# EAGLE design ATTinyAmpDriver (EAGLE 6.4)
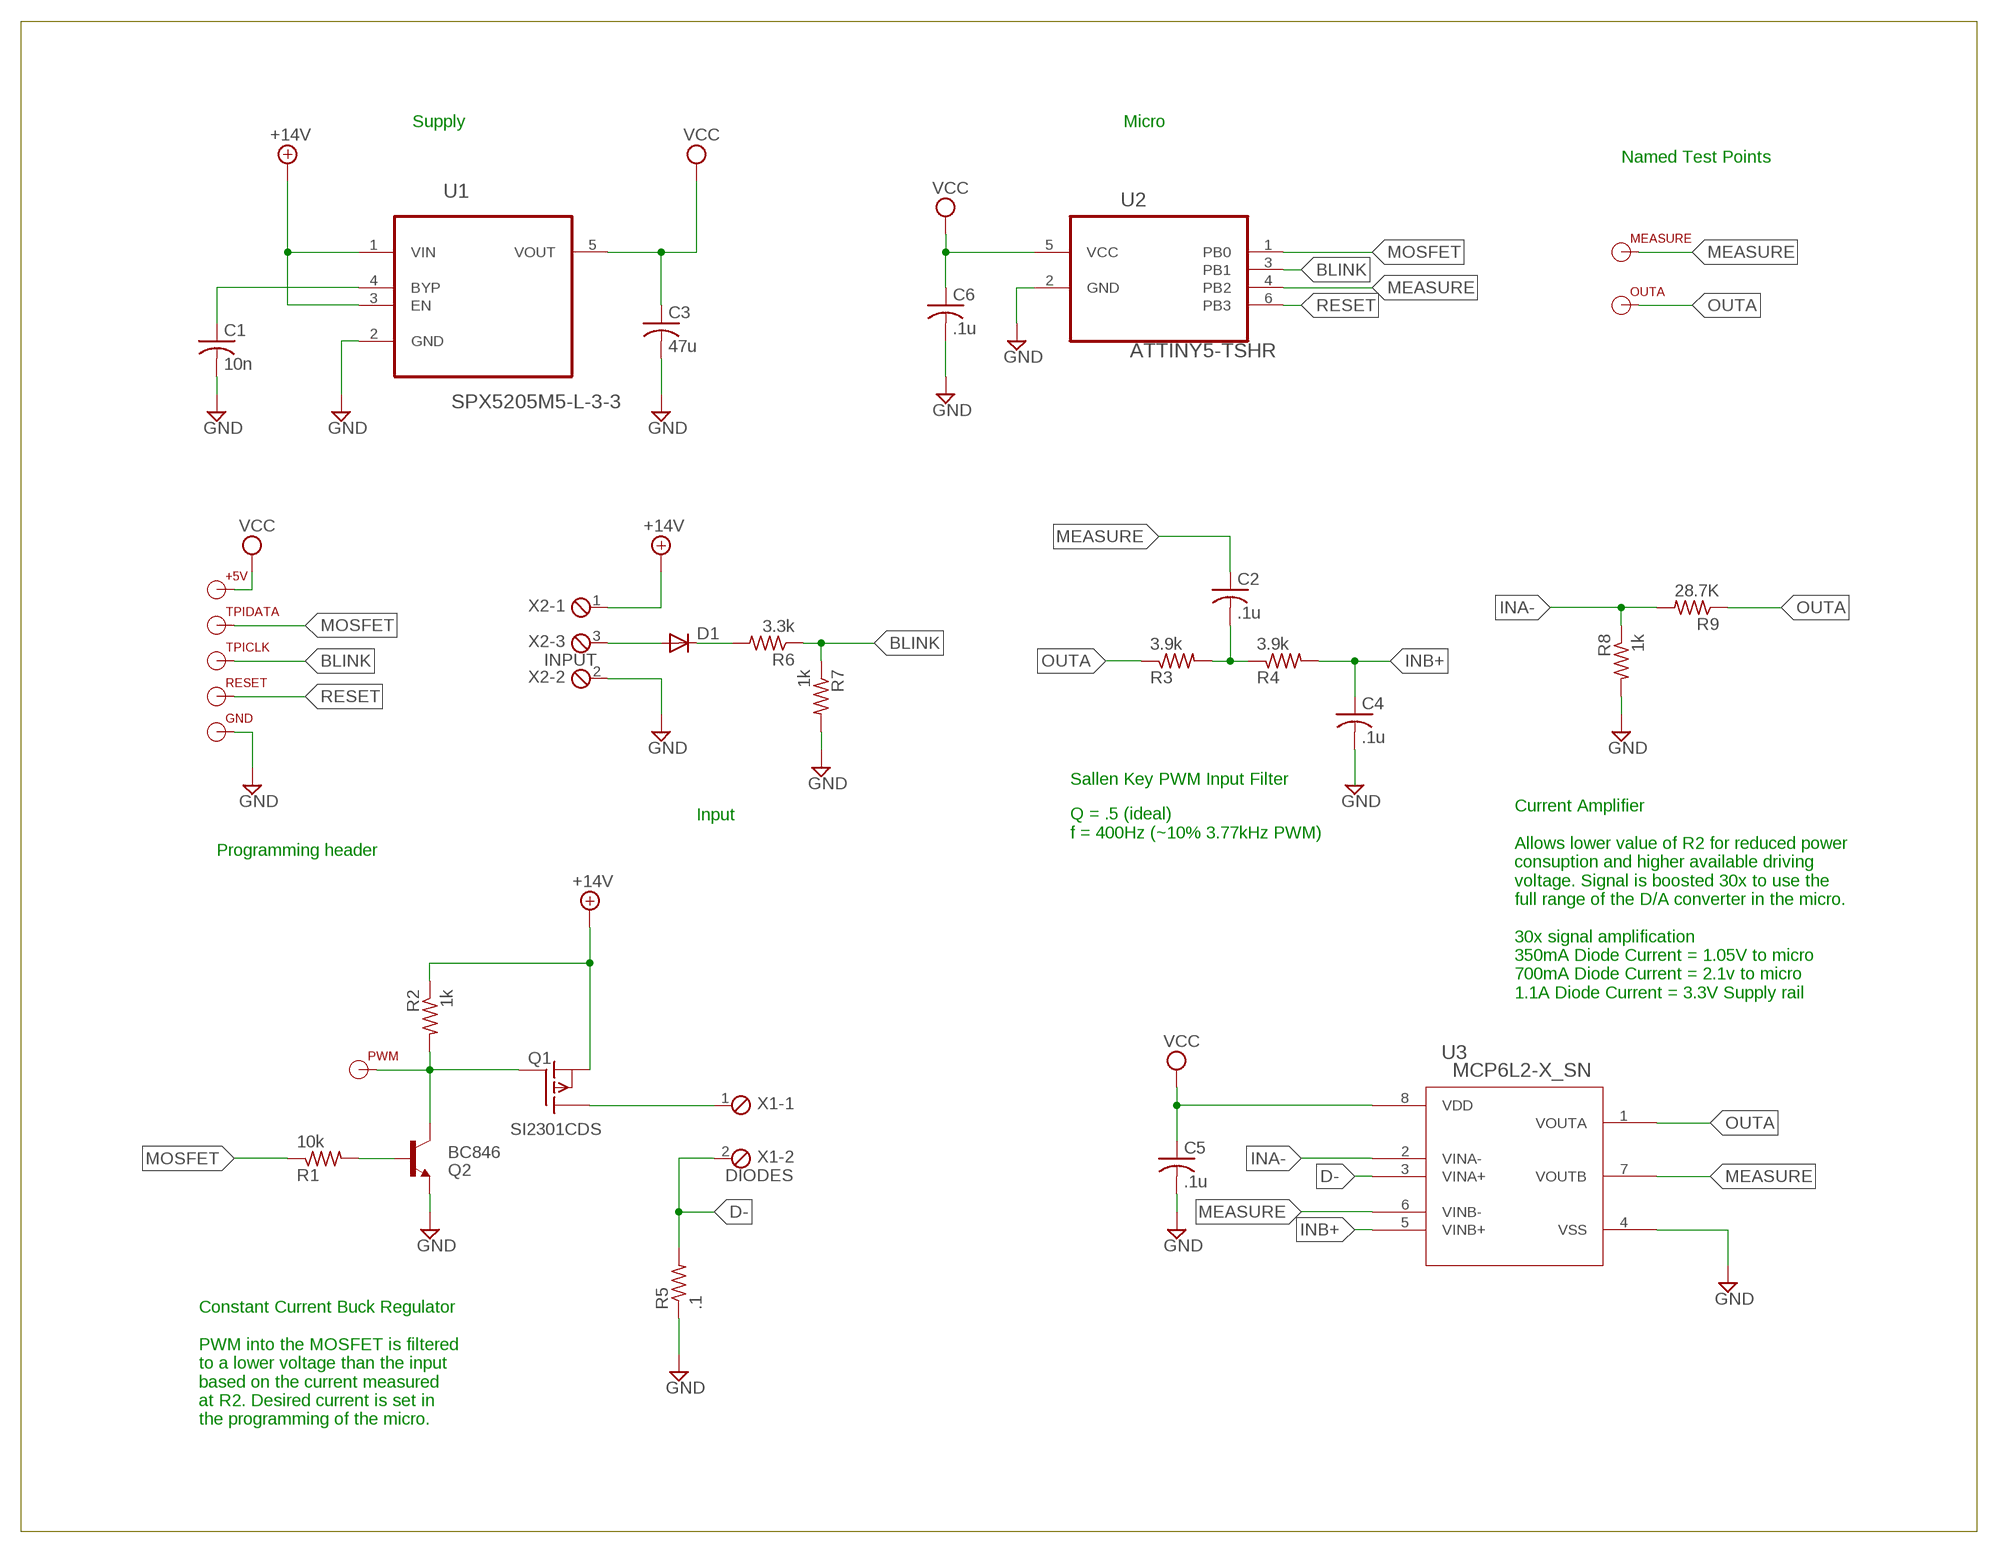
[diagram p0: schematic, sheet 1]

## Parts
+5V  TPI  [TPI_PAD]
C1  10n  C-USC0603  [C0603]
C2  .1u  C-USC0603  [C0603]
C3  47u  C-USC1206  [C1206]
C4  .1u  C-USC0603  [C0603]
C5  .1u  C-USC0603  [C0603]
C6  .1u  C-USC0603  [C0603]
D1  DIODE_0603  [D0603]
GND  TPI  [TPI_PAD]
MEASURE  TPI  [TPI_PAD]
OUTA  TPI  [TPI_PAD]
PWM  TPI  [TPI_PAD]
Q1  SI2301CDS  [SOT-23_POWER]
Q2  BC846  [SOT23]
R1  10k  R-US_R0603  [R0603]
R2  1k  R-US_R0603  [R0603]
R3  3.9k  R-US_R0603  [R0603]
R4  3.9k  R-US_R0603  [R0603]
R5  .1  R-US_R1206  [R1206]
R6  3.3k  R-US_R0603  [R0603]
R7  1k  R-US_R0603  [R0603]
R8  1k  R-US_R0603  [R0603]
R9  28.7K  R-US_R0603  [R0603]
RESET  TPI  [TPI_PAD]
TPICLK  TPI  [TPI_PAD]
TPIDATA  TPI  [TPI_PAD]
U1  SPX5205M5-L-3-3  [SOT95P280X145-5N]
U2  ATTINY5-TSHR  [SOT95P280X145-6N]
U3  MCP6L2-X_SN  [SOIC8-N_MC]
X1  DIODES  MPT2  [2POL254]
X2  INPUT  MPT3  [3POL254]

## Nets
+14V: Q1.P$2(S) R2.1 U1.1(VIN) U1.3(EN) X2.1
BLINK: R6.1 R7.1 TPICLK.P$1(TPI_PIN) U2.3(PB1)
D-: R5.2 U3.3(VINA+) X1.2
GND: C1.2 C3.2 C4.2 C5.2 C6.2 GND.P$1(TPI_PIN) Q2.2(E) R5.1 R7.2 R8.2 U1.2(GND) U2.2(GND) U3.4(VSS) X2.2
INA-: R8.1 R9.2 U3.2(VINA-)
INB+: C4.1 R4.2 U3.5(VINB+)
MEASURE: C2.1 MEASURE.P$1(TPI_PIN) U2.4(PB2) U3.6(VINB-) U3.7(VOUTB)
MOSFET: R1.1 TPIDATA.P$1(TPI_PIN) U2.1(PB0)
N$1: D1.1A(A) X2.3
N$2: C1.1 U1.4(BYP)
N$3: Q1.P$3(D) X1.1
N$4: D1.2C(C) R6.2
N$5: PWM.P$1(TPI_PIN) Q1.P$1(G) Q2.3(C) R2.2
N$6: Q2.1(B) R1.2
N$8: C2.2 R3.2 R4.1
OUTA: OUTA.P$1(TPI_PIN) R3.1 R9.1 U3.1(VOUTA)
RESET: RESET.P$1(TPI_PIN) U2.6(PB3)
VCC: +5V.P$1(TPI_PIN) C3.1 C5.1 C6.1 U1.5(VOUT) U2.5(VCC) U3.8(VDD)

## Notes on the sheet
- Supply | Micro
- Named Test Points
- Sallen Key PWM Input Filter
- Input
- Q = .5 (ideal)
  f = 400Hz (~10% 3.77kHz PWM)
- Programming header
- Current Amplifier
  
  Allows lower value of R2 for reduced power
  consuption and higher available driving 
  voltage. Signal is boosted 30x to use the 
  full range of the D/A converter in the micro.
  
  30x signal amplification
  350mA Diode Current = 1.05V to micro
  700mA Diode Current = 2.1v to micro
  1.1A Diode Current = 3.3V Supply rail
- Constant Current Buck Regulator
  
  PWM into the MOSFET is filtered
  to a lower voltage than the input
  based on the current measured
  at R2. Desired current is set in
  the programming of the micro.

## Library data of the parts
+5V GND MEASURE OUTA PWM RESET TPICLK TPIDATA = Combined:TPI
C1 = resistor:C-US: CAPACITOR, American symbol; DIGIKEY: 445-1311-1-ND; DIGIKEY_COST: .10
C2 C4-C6 = resistor:C-US: CAPACITOR, American symbol; DIGIKEY: 445-1316-1-ND; DIGIKEY_COST: .10
C3 = resistor:C-US: CAPACITOR, American symbol; DIGIKEY: 399-5508-1-ND; DIGIKEY_COST: .67
D1 = Combined:DIODE_0603; DIGIKEY: 641-1002-1-ND; DIGIKEY_COST: .23
Q1 = Combined:SI2301CDS; DIGIKEY: 568-6956-1-ND; DIGIKEY_COST: .69; NEWARK: 16P3701; NEWARK_COST: .37
Q2 = transistor-neu-to92:BC846: NPN TRANSISTOR; DIGIKEY: BC846BMTFCT-ND; DIGIKEY_COST: .17; NEWARK: 75R0728; NEWARK_COST: .14
R1 = resistor:R-US_: RESISTOR, American symbol; DIGIKEY: RMCF0603FT10K0CT-ND; DIGIKEY_COST: .04
R2 R7 R8 = resistor:R-US_: RESISTOR, American symbol; DIGIKEY: RMCF0603FT1K00CT-ND; DIGIKEY_COST: .04
R3 R4 = resistor:R-US_: RESISTOR, American symbol; DIGIKEY: RMCF0603FT3K90CT-ND; DIGIKEY_COST: .04
R5 = resistor:R-US_: RESISTOR, American symbol; DIGIKEY: A103268CT-ND; DIGIKEY_COST: .13
R6 = resistor:R-US_: RESISTOR, American symbol; DIGIKEY: RMCF0603FT3K30CT-ND; DIGIKEY_COST: .04
R9 = resistor:R-US_: RESISTOR, American symbol; DIGIKEY: RMCF0603FT28R7CT-ND; DIGIKEY_COST: .04
U1 = Exar_By_element14_Batch_1:SPX5205M5-L-3-3: 150mA, LOW-NOISE LDO VOLTAGE REGULATOR; DIGIKEY: 1016-1251-ND; DIGIKEY_COST: .60; MPN: SPX5205M5-L-3-3; OC_FARNELL: 1831954; OC_NEWARK: 23R9851; PACKAGE: SOT-23-5; SUPPLIER: EXAR
U2 = Atmel_By_element14_Batch_1:ATTINY5-TSHR: Microcontroller; DESCRIPTION: Microcontroller; DIGIKEY: ATTINY10-TSHRCT-ND; DIGIKEY_COST: .69; MPN: ATTINY5-TSHR; OC_FARNELL: 1841626; OC_NEWARK: 12T1342; PACKAGE: SOT563-6; SUPPLIER: ATMEL
U3 = Combined:MCP6L2-X_SN; DIGIKEY: MCP6L2T-E/SNCT-ND; DIGIKEY_COST: .64
X1 = con-phoenix-254:MPT2: PHOENIX CONNECTOR; OC_FARNELL: unknown; OC_NEWARK: unknown
X2 = con-phoenix-254:MPT3: PHOENIX CONNECTOR; OC_FARNELL: unknown; OC_NEWARK: unknown

## Board
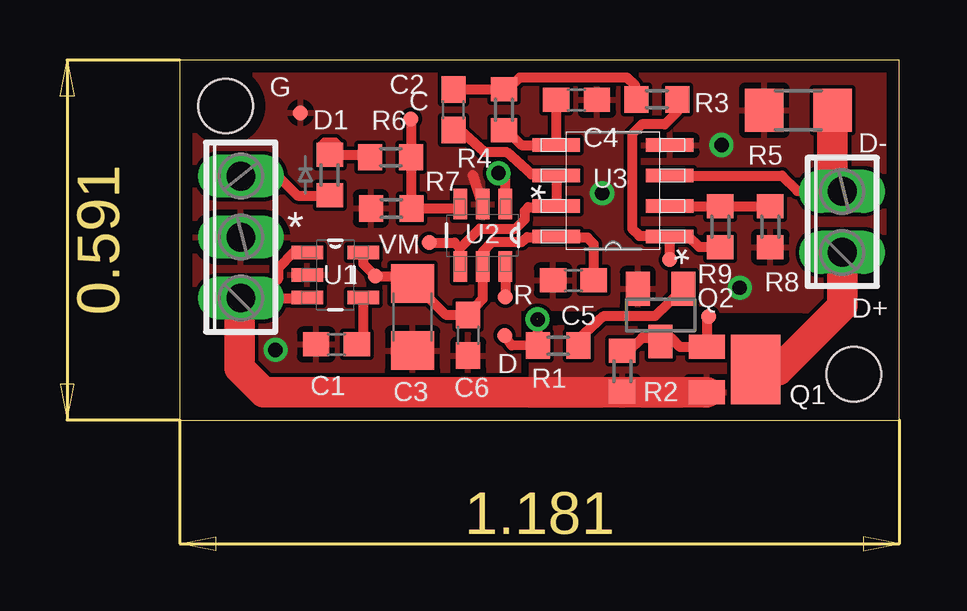
[diagram p1: board, top side]
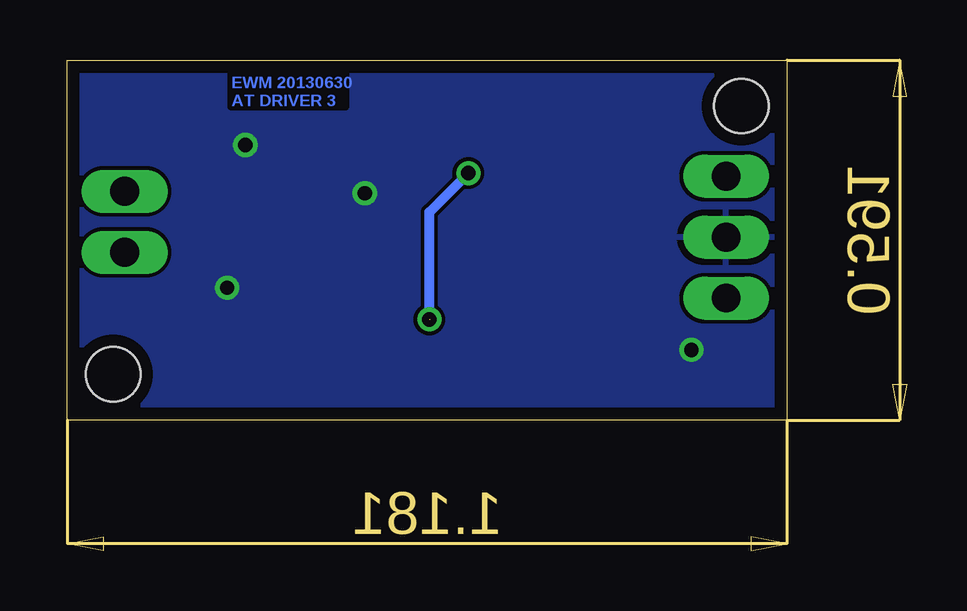
[diagram p2: board, bottom side, seen from below]

Size 30 x 15 mm. Coordinates in mm from the lower left corner, seen from the top.
Outline: 0,0 30,0 30,15 0,15 0,0
Copper layers (1*16): Top 0.035mm / dielectric 1.5mm / Bottom 0.035mm
Design rules "default *": minimum track width 6mil, minimum drill 10mil, track to track 6mil, track to pad 6mil, pad to pad 6mil, via to via 6mil, smd to smd 0mil, copper to edge 20mil, drill to drill 5mil, minimum pad ring 10mil, minimum via ring 8mil, stop-mask expansion 4mil, vias tented up to drill 0mil, thermal gap 10mil
Holes 2.26 mm at 1.91,13.08 28.09,1.91

### Footprints (pad centres in the part's own frame; a part is rotated, then mirrored left to right if it is on the bottom)
TPI_PAD = smd 0.635 x 0.635: P$1 0,0
C0603 = smd 1.1 x 1: 1 -0.85,0; 2 0.85,0
C1206 = smd 1.6 x 1.8: 1 -1.4,0; 2 1.4,0
D0603 = smd 1 x 1.1: 1A -0.85,0; 2C 0.85,0
SOT-23_POWER = smd 1 x 1.5: P$1 -0.95,-2.025; P$2 0.95,-2.025 | smd 2.9 x 2.05: P$3 0,0
SOT23 = smd 1 x 1.4: 1 -0.95,-1.1; 2 0.95,-1.1; 3 0,1.1
R0603 = smd 1 x 1.1: 1 -0.85,0; 2 0.85,0
R1206 = smd 1.6 x 1.803: 1 -1.422,0; 2 1.422,0
SOT95P280X145-5N = smd 1.321 x 0.559: 1 -1.168,0.94; 2 -1.168,0; 3 -1.168,-0.94; 4 1.168,-0.94; 5 1.168,0.94
SOT95P280X145-6N = smd 1.27 x 0.559: 1 -1.295,0.94; 2 -1.295,0; 3 -1.295,-0.94; 4 1.295,-0.94; 5 1.295,0; 6 1.295,0.94
SOIC8-N_MC = smd 1.981 x 0.559: 1 -2.362,1.905; 2 -2.362,0.635; 3 -2.362,-0.635; 4 -2.362,-1.905; 5 2.362,-1.905; 6 2.362,-0.635; 7 2.362,0.635; 8 2.362,1.905
2POL254 = drill 1.2 long: 1 -1.27,0; 2 1.27,0
3POL254 = drill 1.2 long: 1 -2.54,0; 2 0,0; 3 2.54,0

### Placement (x,y rotation side)
+5V  8.15,5.99 0 top
C1  6.53,3.15 180 top
C2  11.4,12.93 90 top
C3  9.7,4.29 270 top
C4  16.54,13.34 0 top
C5  16.41,5.82 180 top
C6  12.01,3.53 270 top
D1  6.25,10.21 90 top
GND  5.03,12.8 0 top
MEASURE  10.39,7.39 0 top
OUTA  20.42,6.68 0 top
PWM  22.05,4.32 0 top
Q1  24,2.11 270 top
Q2  20.04,4.37 180 top
R1  15.77,3.1 0 top
R2  18.44,2.03 90 top
R3  19.89,13.36 180 top
R4  13.51,12.93 270 top
R5  25.78,12.9 0 top
R6  8.79,10.95 180 top
R7  8.81,8.81 180 top
R8  24.61,8.05 270 top
R9  22.53,8.05 90 top
RESET  13.56,5.13 0 top
TPICLK  9.63,12.55 0 top
TPIDATA  13.54,3.53 0 top
U1  6.48,6.05 0 top
U2  12.62,7.7 270 top
U3  18.06,9.55 180 top
X1  27.61,8.26 90 top
X2  2.54,7.62 90 top

### Tracks (layer width: path | path; a pad name or v marks a point on that pad's centre or on a via)
+14V
  Top 0.406: X2.1 3.3,5.08 | 3.3,5.08 5.28,5.08 U1.3 | U1.1 4.75,6.99 4.09,6.33 4.09,5.87 3.3,5.08 | R2.1 18.97,1.16
  Top 1.27: Q1.P$2 18.97,1.16 3.49,1.16 2.49,2.16 2.49,5.03 X2.1
  pour Top: 14.68,3.81 16.79,3.89 19.1,3.81 30.58,3.94 30.48,-0.76 14.68,-0.76
BLINK
  Top 0.406: 11.71,8.81 U2.3 11.68,8.81 R7.1 9.64,8.84 R6.1 TPICLK.P$1
D-
  Top 0.406: U3.3 25.09,10.19 25.73,9.55 27.86,9.55 27.96,9.45 27.94,9.45 X1.2
  Top 1.27: R5.2 27.2,10.19 X1.2
GND  (via drill 0.6)
  Top 0.406: U2.2 12.22,10.21
  other vias: 3.99,2.92 17.6,9.45 22.58,11.46 23.34,5.51
  pour Top: -1.52,16.51 30.48,16.51 30.58,4.52 21.34,4.57 14.1,4.65 14.12,-0.84 -1.27,-1.02
  pour Bottom: -0.77,15.5 30.3,15.5 30.25,-0.43 -0.73,-0.53
INA-
  Top 0.406: U3.2 22.52,8.91 R9.2 R8.1
INB+
  Top 0.406: 15.66,11.49 U3.5 | C4.1 15.69,11.47 U3.5 | R4.2 13.63,12.08 14.25,11.46 U3.5
MEASURE
  Top 0.406: U2.4 11.68,7.16 | 11.68,7.16 12.5,7.98 13.99,7.98 14.38,8.36 14.38,8.71 14.53,8.87 15.65,8.87 U3.7 U3.6 15.65,10.24 14.66,10.24 13.61,11.18 12.68,11.18 11.67,12.08 C2.1 | MEASURE.P$1 11.46,7.39 11.68,7.16
MOSFET  (via drill 0.6)  (1 unrouted)
  Top 0.406: TPIDATA.P$1 13.83,3.11 R1.1 14.92,4.15 14.88,4.19 | U2.1 13.56,10.01 v13.28,10.29
  Bottom 0.406: v14.91,4.19 14.91,8.66 v13.28,10.29
N$1
  Top 0.406: X2.3 4.09,10.16 4.9,9.35 6.24,9.35 D1.1A
N$2
  Top 0.406: 7.52,2.86 C1.1 7.64,3.42 U1.4
N$3
  Top 1.27: X1.1 27.61,4.75 24.94,2.08 24.03,2.08 Q1.P$3
N$4
  Top 0.406: D1.2C 7.83,11.06 R6.2
N$5
  Top 0.406: R2.2 18.71,2.86 19.28,3.43 19.88,3.43 Q2.3 20.48,3.42 20.85,3.05 21.97,3.05 Q1.P$1 21.98,4.32 PWM.P$1
N$6
  Top 0.406: R1.2 16.62,3.37 17.68,4.34 19.81,4.34 Q2.1
N$8
  Top 0.406: C2.2 R4.1 13.7,13.78 14.17,14.28 18.62,14.28 18.97,13.95 18.97,13.43 R3.2
OUTA
  Top 0.406: R3.1 20.74,12.84 20.22,12.32 19.25,12.32 18.85,11.91 18.85,7.98 19.15,7.67 20.4,7.67 U3.1 | U3.1 21.21,7.64 21.64,7.21 22.52,7.21 R9.1 | OUTA.P$1 U3.1
RESET
  Top 0.406: U2.6 RESET.P$1
VCC
  Top 0.406: C5.1 17.26,7.33 16.99,7.59 15.75,7.59 U3.8 15.67,7.62 14.48,7.62 14.25,7.42 13.01,7.42 12.62,7.01 U2.5 12.62,5.04 C6.1 12,4.39 11.07,4.39 9.78,5.69 C3.1 9.4,5.99 +5V.P$1 7.64,6.5 U1.5

### Text on the board
Bottom: EWM 20130630 / AT DRIVER 3
tNames: G | C | D- | V | M | R | D+ | D